# EasyEDA Pro project patched.epro, board PCB1
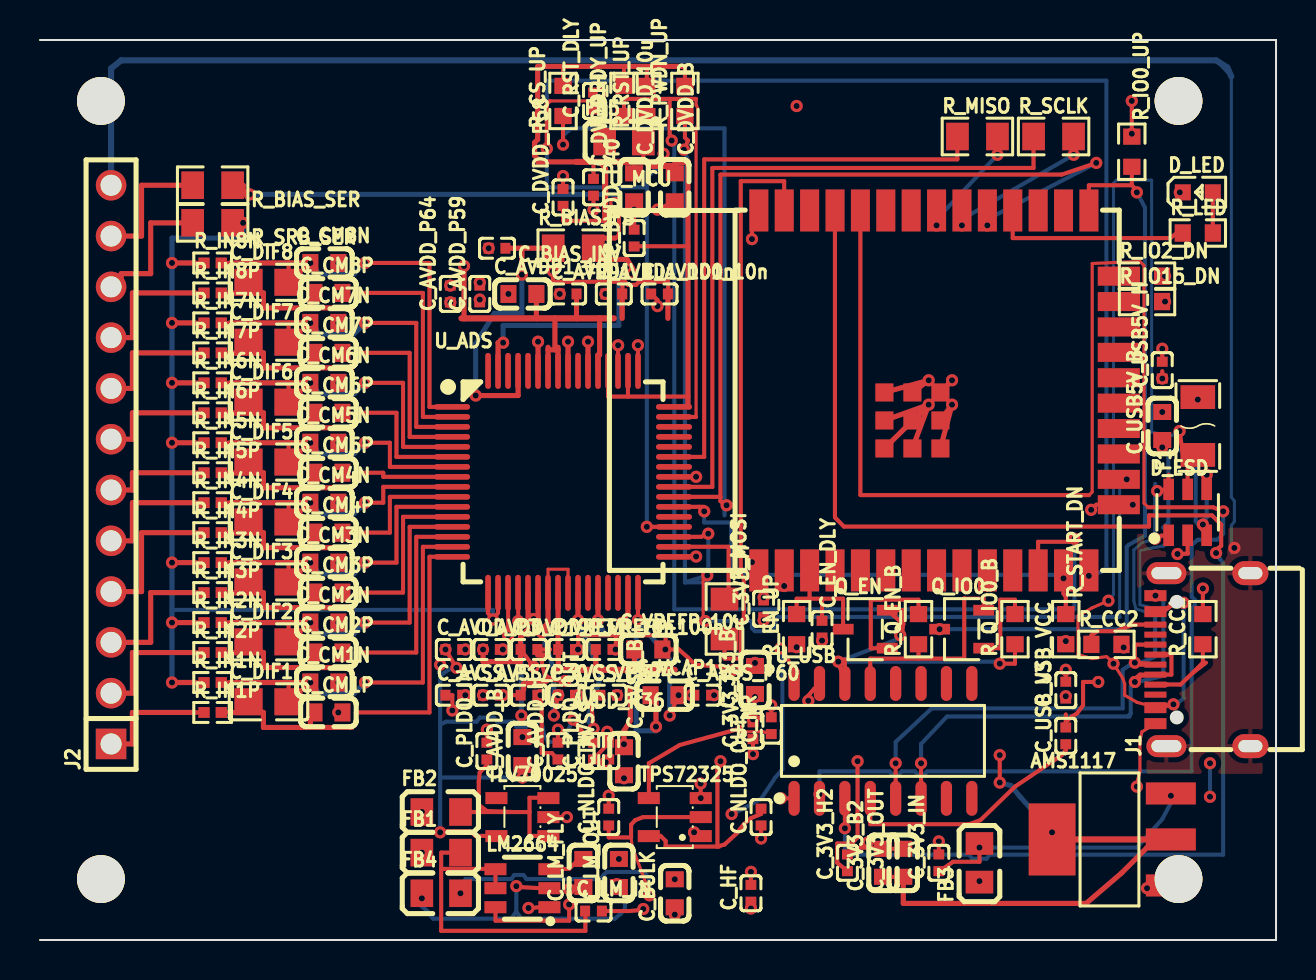
[diagram p5: board, top side]
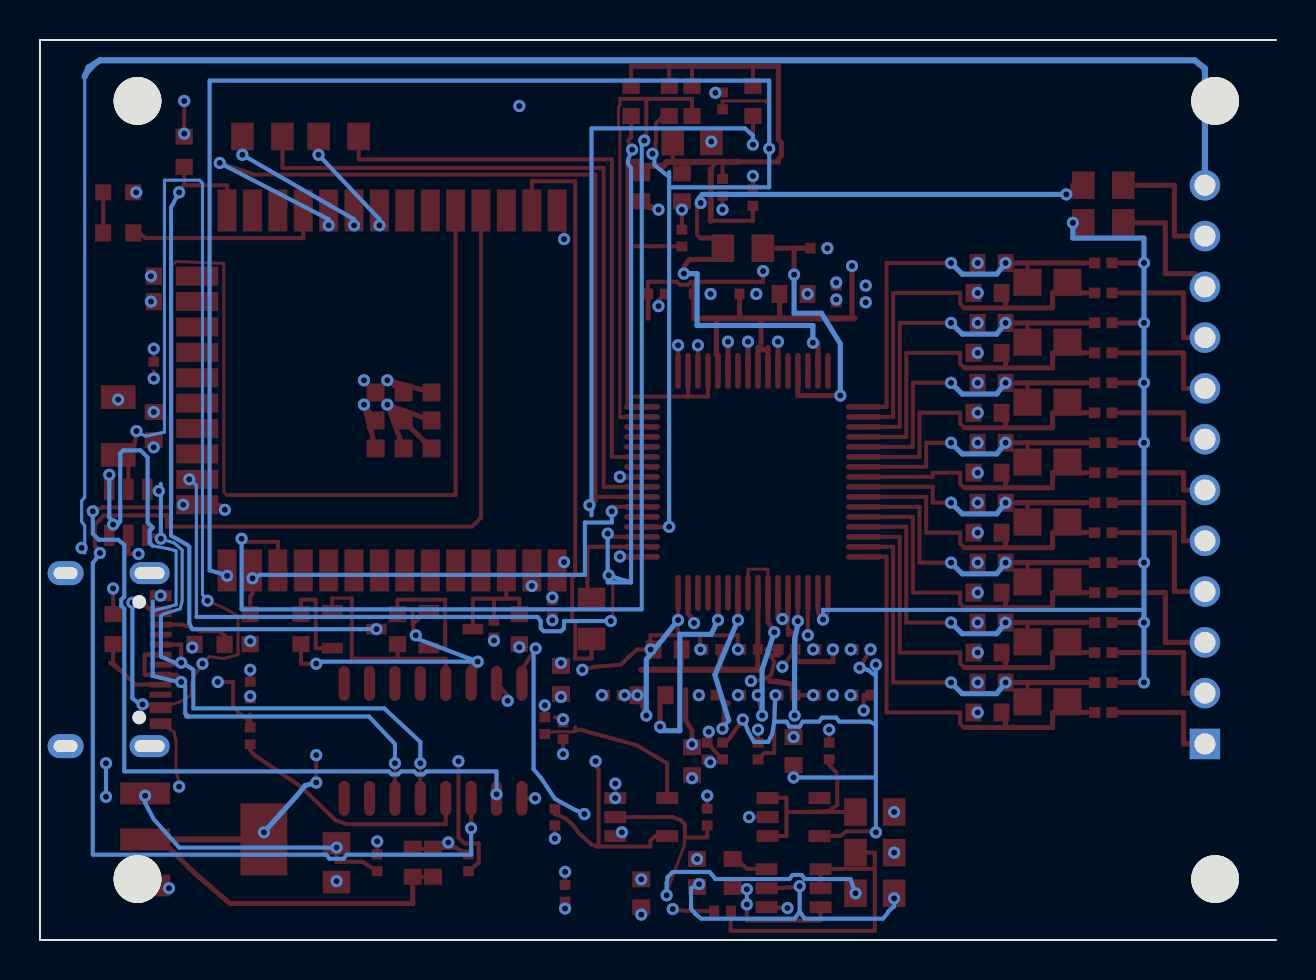
[diagram p6: board, bottom side, seen from below]

Outline 61.82 x 45.01 mm; copper layers: Top Layer, Inner1, Inner2, Bottom Layer. Coordinates in mm from the lower left corner of the outline.
Outline path: 0,45.01 61.82,45.01 61.82,0 0,0
Stack: Top Layer 0.035mm Outer layer thickness 1oz / Dielectric1 0.2104mm 7628 RC49% 8.6mil / Inner1 0.0152mm Inner layer thickness / Dielectric2 1.065mm 1.1mm H/HOZ Copper / Inner2 0.0152mm Inner layer thickness / Dielectric3 0.2104mm 7628 RC49% 8.6mil / Bottom Layer 0.035mm Outer layer thickness 1oz

## Design rules (mm)
spacing copperThickness1oz (default): track to track 0.102, other pairs 0.127 to 0.3
spacing copperThickness2oz: track to track 0.203, other pairs 0.127 to 0.3
track width copperThickness1oz (default): min 0.127, default 0.254, max 2.54
track width copperThickness2oz: min 0.203, default 0.254, max 2.54
differential pair differentialPair (default): width min 0.127, default 0.254, max 2.54; gap min 0.152, default 0.152

## Placement (name value [footprint] x y rotation side)
AMS1117  AMS1117-3.3  [SOT-223-3_L6.5-W3.4-P2.30-LS7.0-BR]  53.59 5.03 0 top
C_3V3_B  1uF  [C0603]  35.76 13 90 top
C_3V3_B2  1uF  [C0603]  42.16 3.86 90 top
C_3V3_H  100nF  [C0402]  35.66 10.47 90 top
C_3V3_H2  100nF  [C0402]  40.39 3.86 90 top
C_3V3_IN  1uF  [C0402]  44.96 3.86 90 top
C_3V3_M  1uF  [C0402]  36.19 16.56 90 top
C_3V3_OUT  1uF  [C0603]  43.18 3.86 90 top
C_AVDD1_1u  1uF  [C0402]  26.42 32.31 0 top
C_AVDD1_10n  100pF  [C0402]  30.99 32.31 0 top
C_AVDD1_10u  1uF  [C0603]  24.13 32.31 0 top
C_AVDD1_100n  100nF  [C0402]  28.7 32.31 0 top
C_AVDD_B  1uF  [C0603]  24.13 9.45 90 top
C_AVDD_H  100nF  [C0402]  25.91 9.45 90 top
C_AVDD_P3  100nF  [C0402]  20.7 14.53 0 top
C_AVDD_P19  100nF  [C0402]  22.58 14.53 0 top
C_AVDD_P31  100nF  [C0402]  24.46 14.53 0 top
C_AVDD_P36  100nF  [C0402]  24.46 12.24 180 top
C_AVDD_P59  100nF  [C0402]  22 32.31 90 top
C_AVDD_P64  100nF  [C0402]  20.52 32.31 90 top
C_AVSS_B  1uF  [C0603]  29.21 8.94 270 top
C_AVSS_H  100nF  [C0402]  28.45 9.45 90 top
C_AVSS_P17  100nF  [C0402]  20.7 12.24 0 top
C_AVSS_P30  100nF  [C0402]  22.58 12.24 0 top
C_AVSS_P37  100nF  [C0402]  26.34 12.24 0 top
C_AVSS_P60  100nF  [C0402]  33.15 12.24 0 top
C_BIAS_INV  100nF  [C0402]  22.86 34.59 180 top
C_BULK  1uF  [C0603]  31.75 2.34 90 top
C_CM1N  1nF  [C0603]  14.22 12.88 0 top
C_CM1P  1nF  [C0603]  14.43 11.38 0 top
C_CM2N  1nF  [C0603]  14.22 15.88 0 top
C_CM2P  1nF  [C0603]  14.43 14.38 0 top
C_CM3N  1nF  [C0603]  14.22 18.87 0 top
C_CM3P  1nF  [C0603]  14.43 17.37 0 top
C_CM4N  1nF  [C0603]  14.22 21.87 0 top
C_CM4P  1nF  [C0603]  14.43 20.37 0 top
C_CM5N  1nF  [C0603]  14.22 24.87 0 top
C_CM5P  1nF  [C0603]  14.43 23.37 0 top
C_CM6N  1nF  [C0603]  14.22 27.86 0 top
C_CM6P  1nF  [C0603]  14.43 26.37 0 top
C_CM7N  1nF  [C0603]  14.22 30.86 0 top
C_CM7P  1nF  [C0603]  14.43 29.36 0 top
C_CM8N  1nF  [C0603]  14.22 33.86 0 top
C_CM8P  1nF  [C0603]  14.43 32.36 0 top
C_DIF1  100nF  [C0805]  11.43 11.91 0 top
C_DIF2  100nF  [C0805]  11.43 14.91 0 top
C_DIF3  100nF  [C0805]  11.43 17.91 0 top
C_DIF4  100nF  [C0805]  11.43 20.9 0 top
C_DIF5  100nF  [C0805]  11.43 23.9 0 top
C_DIF6  100nF  [C0805]  11.43 26.9 0 top
C_DIF7  100nF  [C0805]  11.43 29.9 0 top
C_DIF8  100nF  [C0805]  11.43 32.89 0 top
C_DVDD_10u  1uF  [C0603]  29.72 37.64 270 top
C_DVDD_B  1uF  [C0603]  31.75 37.64 270 top
C_DVDD_H  100nF  [C0402]  27.69 37.64 270 top
C_DVDD_P40  100nF  [C0402]  29.72 35.1 90 top
C_DVDD_P58  100nF  [C0402]  26.16 37.14 90 top
C_EN_DLY  100nF  [C0402]  39.12 15.55 270 top
C_HF  100nF  [C0402]  35.56 2.34 90 top
C_LM_FLY  1uF  [C0603]  27.18 3.35 90 top
C_LM_IN  1uF  [C0402]  27.69 1.45 0 top
C_LM_OUT  1uF  [C0603]  28.96 3.35 90 top
C_NLDO_IN  1uF  [C0402]  28.45 6.15 90 top
C_NLDO_OUT  1uF  [C0402]  36.07 6.15 90 top
C_NR  100pF  [C0402]  36.58 10.72 90 top
C_PLDO_IN  1uF  [C0402]  22.35 9.45 90 top
C_PLDO_OUT  1uF  [C0402]  27.69 9.45 90 top
C_RST_DLY  100nF  [C0402]  27.69 41.96 90 top
C_USB5V_B  1uF  [C0603]  56.13 25.7 90 top
C_USB5V_H  100nF  [C0402]  56.13 28.5 90 top
C_USB_V3  100nF  [C0402]  51.31 10.21 90 top
C_USB_VCC  100nF  [C0402]  51.31 12.5 90 top
C_VCAP1  1uF  [C0603]  31.24 12.24 0 top
C_VCAP4  1uF  [C0402]  28.45 12.24 0 top
C_VREFP_10n  100pF  [C0402]  26.34 14.53 0 top
C_VREFP_10u  1uF  [C0603]  30.43 14.53 0 top
C_VREFP_100n  100nF  [C0402]  28.22 14.53 0 top
D_ESD  USBLC6-2SC6  [SOT-23-6_L2.9-W1.6-P0.95-LS2.8-BL]  57.4 21.39 0 top
D_LED  19-217/GHC-YR1S2/3T  [LED0603-RD]  57.91 37.39 0 top
F1  JK-NSMD050-13.2V  [F1206]  57.91 25.7 90 top
FB1  GZ2012D601TF  [L0805]  20.07 4.37 0 top
FB2  GZ2012D601TF  [L0805]  20.07 6.4 0 top
FB3  GZ2012D601TF  [L0805]  46.99 3.86 90 top
FB4  GZ2012D601TF  [L0805]  20.07 2.34 0 top
FB5  GZ2012D601TF  [L0805]  29.21 39.93 0 top
J1  TYPE-C 16PIN 2MD(073)  [USB-C-SMD_TYPE-C-6PIN-2MD-073]  58.17 14.02 90 top
J2  PZ254V-11-12P  [HDR-TH_12P-P2.54-V-M]  3.56 23.77 90 top
LM2664  LM2664M6X/NOPB  [SOT-23-6_L2.9-W1.6-P0.95-LS2.8-BR]  24.13 2.59 0 top
NOREF  -  [Pad_e526]  56.95 41.96 0 top
NOREF#2  -  [Pad_e528]  56.95 3.05 0 top
NOREF#3  -  [Pad_e525]  3.05 41.96 0 top
NOREF#4  -  [Pad_e527]  3.05 3.05 0 top
Q_EN  S8050 J3Y(RANGE:200-350)  [SOT-23-3_L3.0-W1.7-P0.95-LS2.9-BR]  41.28 15.55 0 top
Q_IO0  S8050 J3Y(RANGE:200-350)  [SOT-23-3_L3.0-W1.7-P0.95-LS2.9-BR]  46.1 15.55 0 top
R_BIAS_FB  1MΩ  [R0805]  26.67 34.59 0 top
R_BIAS_SER  1MΩ  [R0805]  8.64 37.74 180 top
R_CC1  5.1kΩ  [R0603]  58.17 15.55 90 top
R_CC2  5.1kΩ  [R0603]  53.34 14.78 0 top
R_CS_UP  10kΩ  [R0603]  26.16 41.96 90 top
R_DRDY_UP  10kΩ  [R0603]  29.21 41.96 90 top
R_EN_UP  10kΩ  [R0603]  37.85 15.55 90 top
R_IN1N  10kΩ  [R0402]  8.64 12.88 0 top
R_IN1P  10kΩ  [R0402]  8.64 11.38 0 top
R_IN2N  10kΩ  [R0402]  8.64 15.88 0 top
R_IN2P  10kΩ  [R0402]  8.64 14.38 0 top
R_IN3N  10kΩ  [R0402]  8.64 18.87 0 top
R_IN3P  10kΩ  [R0402]  8.64 17.37 0 top
R_IN4N  10kΩ  [R0402]  8.64 21.87 0 top
R_IN4P  10kΩ  [R0402]  8.64 20.37 0 top
R_IN5N  10kΩ  [R0402]  8.64 24.87 0 top
R_IN5P  10kΩ  [R0402]  8.64 23.37 0 top
R_IN6N  10kΩ  [R0402]  8.64 27.86 0 top
R_IN6P  10kΩ  [R0402]  8.64 26.37 0 top
R_IN7N  10kΩ  [R0402]  8.64 30.86 0 top
R_IN7P  10kΩ  [R0402]  8.64 29.36 0 top
R_IN8N  10kΩ  [R0402]  8.64 33.86 0 top
R_IN8P  10kΩ  [R0402]  8.64 32.36 0 top
R_IO0_UP  10kΩ  [R0603]  54.61 39.42 270 top
R_IO2_DN  10kΩ  [R0603]  55.37 33.2 0 top
R_IO15_DN  10kΩ  [R0603]  55.37 31.93 0 top
R_LED  10kΩ  [R0603]  57.91 35.36 0 top
R_MISO  0Ω  [R0805]  46.89 40.18 0 top
R_MOSI  0Ω  [R0805]  34.24 16.05 270 top
R_PWDN_UP  10kΩ  [R0603]  32.26 41.96 90 top
R_Q_EN_B  10kΩ  [R0603]  43.94 15.55 90 top
R_Q_IO0_B  10kΩ  [R0603]  48.77 15.55 90 top
R_RST_UP  10kΩ  [R0603]  30.35 41.96 90 top
R_SCLK  0Ω  [R0805]  50.7 40.18 0 top
R_SRB_SER  0Ω  [R0805]  8.64 35.86 180 top
R_START_DN  10kΩ  [R0603]  51.31 15.55 270 top
TLV70025  TLV70025DDCR  [SOT-23-5_L3.0-W1.7-P0.95-LS2.8-BR]  24.13 6.15 0 top
TPS72325  TPS72325DBVR  [SOT-23-5_L3.0-W1.7-P0.95-LS2.8-BR]  31.75 6.15 0 top
U_ADS  ADS1299IPAGR  [TQFP-64_L10.0-W10.0-P0.50-LS12.0-TL]  26.16 22.91 0 top
U_MCU  2.4GHz  [WIFI-SMD_ESP32-WROOM-32E]  44.96 27.48 0 top
U_USB  CH340C  [SOP-16_L10.0-W3.9-P1.27-LS6.0-BL]  42.16 9.96 0 top

## Footprints (pads in the part's own frame, mm; a bottom-side part is the same pattern mirrored in y, then rotated)
C0402
  rect 0.5x0.54 smd: 1(-0.42,0) 2(0.42,0)
C0603
  rect 0.8x0.9 smd: 1(-0.7,0) 2(0.7,0)
C0805
  rect 1.41x1.35 smd: 1(-1,0) 2(1,0)
F1206
  rect 1.19x1.728 smd: 1(-1.445,0) 2(1.445,0)
HDR-TH_12P-P2.54-V-M
  rect 1.524x1.524 hole 1.05: 1(-13.97,0)
  round 1.524 hole 1.05: 2(-11.43,0) 3(-8.89,0) 4(-6.35,0) 5(-3.81,0) 6(-1.27,0) 7(1.27,0) 8(3.81,0) 9(6.35,0) 10(8.89,0) 11(11.43,0) 12(13.97,0)
L0805
  rect 1.133x1.377 smd: 1(-0.966,0) 2(0.966,0)
LED0603-RD
  rect 0.8x0.8 smd: 1(-0.749,0) 2(0.749,0)
Pad_e525
  round 2.388 hole 2.388: H1(0,0)
Pad_e526
  round 2.388 hole 2.388: H2(0,0)
Pad_e527
  round 2.388 hole 2.388: H3(0,0)
Pad_e528
  round 2.388 hole 2.388: H4(0,0)
R0402
  rect 0.566x0.54 smd: 1(-0.433,0) 2(0.433,0)
R0603
  rect 0.806x0.864 smd: 1(-0.753,0) 2(0.753,0)
R0805
  rect 1.133x1.377 smd: 1(-1,0) 2(1,0)
SOP-16_L10.0-W3.9-P1.27-LS6.0-BL
  oval 0.56x1.745 smd: 1(-4.445,-2.873) 2(-3.175,-2.873) 3(-1.905,-2.873) 4(-0.635,-2.873) 5(0.635,-2.873) 6(1.905,-2.873) 7(3.175,-2.873) 8(4.445,-2.873) 9(4.445,2.873) 10(3.175,2.873) 11(1.905,2.873) 12(0.635,2.873) 13(-0.635,2.873) 14(-1.905,2.873) 15(-3.175,2.873) 16(-4.445,2.873)
SOT-23-3_L3.0-W1.7-P0.95-LS2.9-BR
  rect 1.038x0.532 smd: 1(1.101,-0.95) 2(1.101,0.95) 3(-1.101,0)
SOT-23-5_L3.0-W1.7-P0.95-LS2.8-BR
  rect 1.1x0.6 smd: 1(1.3,-0.95) 2(1.3,0) 3(1.3,0.95) 4(-1.3,0.95) 5(-1.3,-0.95)
SOT-23-6_L2.9-W1.6-P0.95-LS2.8-BL
  rect 0.532x1.072 smd: 1(-0.95,-1.149) 2(0,-1.149) 3(0.95,-1.149) 4(0.95,1.149) 5(0,1.149) 6(-0.95,1.149)
SOT-23-6_L2.9-W1.6-P0.95-LS2.8-BR
  rect 1.1x0.6 smd: 1(1.35,-0.95) 2(1.35,0) 3(1.35,0.95) 4(-1.35,0.95) 5(-1.35,0) 6(-1.35,-0.95)
SOT-223-3_L6.5-W3.4-P2.30-LS7.0-BR
  rect 2.5x1.1 smd: 1(2.97,-2.3) 2(2.97,0) 3(2.97,2.3)
  rect 2.34x3.6 smd: 4(-2.97,0)
TQFP-64_L10.0-W10.0-P0.50-LS12.0-TL
  oval 1.8x0.28 smd: 1(-5.55,3.75) 2(-5.55,3.25) 3(-5.55,2.75) 4(-5.55,2.25) 5(-5.55,1.75) 6(-5.55,1.25) 7(-5.55,0.75) 8(-5.55,0.25) 9(-5.55,-0.25) 10(-5.55,-0.75) 11(-5.55,-1.25) 12(-5.55,-1.75) 13(-5.55,-2.25) 14(-5.55,-2.75) 15(-5.55,-3.25) 16(-5.55,-3.75) 33(5.55,-3.75) 34(5.55,-3.25) 35(5.55,-2.75) 36(5.55,-2.25) 37(5.55,-1.75) 38(5.55,-1.25) 39(5.55,-0.75) 40(5.55,-0.25) 41(5.55,0.25) 42(5.55,0.75) 43(5.55,1.25) 44(5.55,1.75) 45(5.55,2.25) 46(5.55,2.75) 47(5.55,3.25) 48(5.55,3.75)
  oval 0.28x1.8 smd: 17(-3.75,-5.55) 18(-3.25,-5.55) 19(-2.75,-5.55) 20(-2.25,-5.55) 21(-1.75,-5.55) 22(-1.25,-5.55) 23(-0.75,-5.55) 24(-0.25,-5.55) 25(0.25,-5.55) 26(0.75,-5.55) 27(1.25,-5.55) 28(1.75,-5.55) 29(2.25,-5.55) 30(2.75,-5.55) 31(3.25,-5.55) 32(3.75,-5.55) 49(3.75,5.55) 50(3.25,5.55) 51(2.75,5.55) 52(2.25,5.55) 53(1.75,5.55) 54(1.25,5.55) 55(0.75,5.55) 56(0.25,5.55) 57(-0.25,5.55) 58(-0.75,5.55) 59(-1.25,5.55) 60(-1.75,5.55) 61(-2.25,5.55) 62(-2.75,5.55) 63(-3.25,5.55) 64(-3.75,5.55)
USB-C-SMD_TYPE-C-6PIN-2MD-073
  rect 0.55x1.1 smd: 1(-3.2,2.375) 2(-2.4,2.375) 11(2.4,2.375) 12(3.2,2.375)
  rect 0.3x1.1 smd: 3(-1.75,2.375) 4(-1.25,2.375) 5(-0.75,2.375) 6(-0.25,2.375) 7(0.25,2.375) 8(0.75,2.375) 9(1.25,2.375) 10(1.75,2.375)
  oval 1.1x2 hole 0.6x1.5: 13(-4.325,1.825) 14(4.325,1.825)
  oval 1.2x1.8 hole 0.6x1.2: 13(-4.325,-2.375) 14(4.325,-2.375)
WIFI-SMD_ESP32-WROOM-32E
  rect 0.95x2.1 smd: 1(-9.002,-9) 2(-7.732,-9) 3(-6.463,-9) 4(-5.192,-9) 5(-3.922,-9) 6(-2.652,-9) 7(-1.383,-9) 8(-0.113,-9) 9(1.157,-9) 10(2.428,-9) 11(3.697,-9) 12(4.968,-9) 13(6.237,-9) 14(7.508,-9) 25(7.508,9) 26(6.237,9) 27(4.968,9) 28(3.697,9) 29(2.428,9) 30(1.157,9) 31(-0.113,9) 32(-1.383,9) 33(-2.652,9) 34(-3.922,9) 35(-5.192,9) 36(-6.463,9) 37(-7.732,9) 38(-9.002,9)
  rect 2.1x0.95 smd: 15(9.002,-5.715) 16(9.002,-4.445) 17(9.002,-3.175) 18(9.002,-1.905) 19(9.002,-0.635) 20(9.002,0.635) 21(9.002,1.905) 22(9.002,3.175) 23(9.002,4.445) 24(9.002,5.715)
  rect 0.9x0.9 smd: 39(-2.721,-0.1) 39(-2.721,-1.5) 39(-2.721,-2.9) 39(-1.321,-0.1) 39(-1.321,-1.5) 39(-1.321,-2.9) 39(0.079,-0.1) 39(0.079,-1.5) 39(0.079,-2.9)

## Nets
As in the schematic, except:
AVDD: C_AVDD1_1u.1 C_AVDD1_10n.1 C_AVDD1_10u.1 C_AVDD1_100n.1 C_AVDD_B.1 C_AVDD_H.1 C_AVDD_P3.1 C_AVDD_P19.1 C_AVDD_P31.1 C_AVDD_P36.1 C_AVDD_P59.1 C_AVDD_P64.1 C_PLDO_OUT.2 TLV70025.5 U_ADS.19 U_ADS.21 U_ADS.22 U_ADS.31 U_ADS.54 U_ADS.56 U_ADS.59
GND: AMS1117.1 C_3V3_B.2 C_3V3_B2.2 C_3V3_H.2 C_3V3_H2.2 C_3V3_IN.2 C_3V3_M.2 C_3V3_OUT.2 C_AVDD_B.2 C_AVDD_H.2 C_AVDD_P3.2 C_AVDD_P19.2 C_AVDD_P31.2 C_AVDD_P36.2 C_AVDD_P59.2 C_AVDD_P64.2 C_AVSS_B.2 C_AVSS_H.2 C_AVSS_P17.2 C_AVSS_P30.2 C_AVSS_P37.2 C_AVSS_P60.2 C_BIAS_INV.2 C_BULK.2 C_CM1N.2 C_CM1P.2 C_CM2N.2 C_CM2P.2 C_CM3N.2 C_CM3P.2 C_CM4N.2 C_CM4P.2 C_CM5N.2 C_CM5P.2 C_CM6N.2 C_CM6P.2 C_CM7N.2 C_CM7P.2 C_CM8N.2 C_CM8P.2 C_DVDD_10u.2 C_DVDD_B.2 C_DVDD_H.2 C_DVDD_P40.2 C_DVDD_P58.2 C_EN_DLY.2 C_HF.2 C_LM_IN.2 C_LM_OUT.2 C_NLDO_IN.2 C_NLDO_OUT.1 C_NR.2 C_PLDO_IN.2 C_PLDO_OUT.1 C_RST_DLY.2 C_USB5V_B.2 C_USB5V_H.2 C_USB_V3.2 C_USB_VCC.2 D_ESD.2 D_LED.1 J1.1 J1.12 LM2664.1 R_CC1.2 R_CC2.2 R_IO2_DN.2 R_IO15_DN.2 R_START_DN.2 TLV70025.2 TPS72325.1 TPS72325.3 U_ADS.33 U_ADS.41 U_ADS.49 U_ADS.51 U_MCU.1 U_MCU.15 U_MCU.38 U_MCU.39 U_USB.1 U_USB.15
V_NLDO_IN: C_NLDO_IN.1 FB4.2 TPS72325.2

Pads without a net: J1 3 9; NOREF H2; NOREF#2 H4; NOREF#3 H1; NOREF#4 H3; TLV70025 4; U_ADS 27 29 30 37 42 44 45 46 55 60 62 64; U_MCU 4 5 6 7 8 9 10 11 17 18 19 20 21 22 26 27 32 33 36; U_USB 7 8 9 10 11 12

## Via types
v1: diameter 0.61, hole 0.305, Top Layer to Bottom Layer, 238 vias

## Routing (per net, layer and track width the routed paths; a pad name or vN(x,y) marks a point on that pad's centre or on a via; arc(x,y) is an arc through that point)
AVDD: length 53.5
  Top Layer w0.203: v1(23.43,32.31) 23.43,32.51 ; 20.13,14.53 v1(20.28,14.53) v1(20.83,13.61) ; 20.07,5.39 20.32,5.44 21.49,5.44 21.79,5.21 22.3,5.21 ; v1(28.28,32.31) 28.28,32.44 ; 24.42,15.24 24.42,16.1 ; 26.7,11 26.82,10.82 27.13,10.41 27.48,9.91 27.23,10.21 26.92,10.67 26.77,10.82 26.77,10.87 ; 30.58,32.31 30.89,32 v1(30.89,31.7) ; 22.01,14.53 v1(22.16,14.53) ; 23.42,17.36 23.42,15.34 v1(23.42,15.24) ; 20.37,31.89 v1(20.52,31.89) 20.52,31.74 ; v1(25.03,12.24) C_AVDD_P36.1 ; v1(22,32.03) C_AVDD_P59.1 ; C_AVDD1_10n.1 30.57,32.44 ; v1(26,32.31) 26,32.44 ; v1(24.69,16.05) 24.59,16.1 24.42,16.31 ; v1(24.69,13.67) C_AVDD_P31.1 ; v1(24.13,8.13) 24.13,8.74 ; C_AVDD_H.1 25.6,9.35 25.09,9.35 25.09,11.73 25.04,12.14 25.04,12.24
  Top Layer w0.254: 22.16,14.25 22.16,13.92 24.03,13.92 24.03,15.14 24.41,15.55 ; 24.42,16.1 24.91,16.1 24.91,17.36 ; U_ADS.54 v1(27.41,29.92) ; U_ADS.56 v1(26.41,29.92) ; 29.11,16 29.41,16.31 29.41,17.36 ; U_ADS.59 v1(24.91,29.92) ; 24.41,17.36 24.41,16.1
  Bottom Layer w0.203: 20.01,10.77 20.01,13.21 ; 20.01,10.77 20.01,8.13 ; 20.01,10.77 20.32,10.92 21.84,10.92 22,11.13 22.71,11.13 22.86,10.92 23.67,10.92 23.82,10.67 24.33,10.67 24.49,10.92 25.09,10.92 ; 20.01,13.21 20.42,13.51 v1(20.83,13.61) ; 20.01,13.21 v1(20.01,13.77) ; 25.09,10.92 25.2,10.31 25.4,9.91 26.11,9.91 26.42,10.47 26.57,10.87 v1(26.67,11.02) 26.77,10.92 ; 25.09,10.92 25.04,12.09 25.04,12.24 ; 20.01,8.13 v1(24.13,8.13) ; 20.01,8.13 v1(20.01,5.39)
  vias: v1(29.11,15.85)
AVSS: length 82.4
  Top Layer w0.152: U_ADS.23 25.41,18.54 26.41,18.54 U_ADS.25 ; 28.45,8.78 v1(28.3,8.89)
  Top Layer w0.203: 29.13,32.31 29.13,32.92 ; 29.13,32.92 29.26,32.92 29.41,32.77 29.82,32.77 29.97,32.92 31.42,32.92 31.42,32.31 ; 29.13,32.92 25.65,32.92 v1(25.65,33.45) ; v1(31.28,14.53) 31.13,14.53 ; v1(34.7,13.51) 34.09,13.67 32.77,13.77 32.41,14.12 31.95,14.53 31.29,14.53 31.29,15.24 29.92,15.24 ; 28.8,15.24 29.92,15.24 ; 28.8,15.24 26.92,15.24 26.92,14.53 ; 28.8,15.24 28.8,14.53 ; 29.92,15.24 29.92,16 ; 36.07,6.58 36.07,6.3 35.56,6.1 35.2,5.79 34.85,5.33 34.24,4.78 33.88,4.67 ; 33.88,4.67 33.99,4.67 ; 33.88,4.67 31.29,4.67 31.29,4.95 31.04,5.21 TPS72325.5 ; 33.88,4.67 33.88,8.53 34.04,8.74 v1(34.04,8.94) ; 29.02,12.24 v1(28.87,12.24) ; 25.77,12.24 v1(25.92,12.24) v1(25.71,11.23) ; v1(32.58,12.24) C_AVSS_P60.1 ; v1(29.21,9.79) C_AVSS_B.1 ; v1(28.79,14.53) 28.64,14.53 ; 28.45,8.78 C_AVSS_H.1 ; v1(23.92,15.95) 23.92,17.36 ; v1(22.16,12.24) 22.16,12.38 ; 32.09,12.24 31.94,12.24 v1(31.5,11.23) ; v1(26.91,14.53) C_VREFP_10n.2 ; 29.91,16.18 U_ADS.32 ; 20.13,12.24 20.28,12.24 ; v1(20.62,11.48) 20.62,12.24 20.29,12.24
  Top Layer w0.254: U_ADS.58 25.41,29.52 ; 25.41,29.52 25.76,29.52 ; 25.41,29.52 25.41,29.64 ; 27.91,28.46 27.91,29.26 27.99,29.26 27.99,31.09 ; 25.91,29.52 25.91,29.64 ; 25.91,29.52 25.76,29.52 ; 25.91,29.52 U_ADS.57 ; U_ADS.23 25.41,15.9 25.2,15.6 25.09,15.49 ; 29.91,16.18 v1(29.91,16) ; C_AVDD1_10n.2 31.41,31.09 ; v1(21.21,33.71) 21.21,31.09 ; 25.76,29.52 25.76,31.09 ; 29.21,9.92 29.21,10.47 29.53,10.97 29.53,12.52 ; 29.12,32.31 29.12,31.09 ; C_AVDD1_1u.2 26.84,31.09 ; 24.83,32.31 24.83,31.09
  Top Layer w0.305: 21.08,31.09 28.7,31.09
  Bottom Layer w0.254: v1(24.08,11.23) 24.08,15.04 23.92,15.8 ; v1(31.5,11.23) 31.5,14.02 v1(29.91,16) ; v1(25.09,15.39) 25.71,13.51 v1(25.71,11.23)
  vias: v1(31.94,12.24)
DVDD: length 52.1
  Top Layer w0.203: 30.35,42.71 30.35,43.69 ; 31.75,38.34 31.75,38.91 ; 32.41,34.7 29.72,34.7 ; 32.41,27.18 29.41,27.18 ; 29.41,27.18 29.41,27.64 ; 29.41,27.18 28.41,27.18 28.41,27.64 ; 27.69,38.06 27.69,38.91 ; 26.16,42.71 26.16,43.69 ; 27.84,38.91 28.04,38.84 28.27,38.56 ; 28.27,35.97 26.16,35.97 26.16,36.73 ; 32.26,42.71 32.26,43.69 ; 29.72,38.34 29.72,38.91 ; 29.21,42.71 29.21,43.69 ; 30.18,39.29 30.18,38.91
  Top Layer w0.254: 32.41,26.75 32.41,38.91 ; 26.82,38.91 24.89,38.91 24.89,39.07 24.74,39.22 24.74,39.88 24.89,40.03 24.89,43.69 32.26,43.69
  Top Layer w0.305: 32.41,38.91 31.9,38.91 31.75,38.71 30.63,38.71 30.48,38.91 26.82,38.91 ; 28.27,35.97 28.27,38.56
GND: length 80.4
  Top Layer w0.152: 28.25,10.31 v1(28.37,10.41) ; 38.33,12.09 v1(38.43,11.96) ; R_CC2.2 v1(54.2,14.63) ; v1(55.37,2.59) 55.68,2.64 56.57,2.72 ; v1(55.79,17.22) 55.79,17.42 ; J1.1 55.12,10.41 55.02,9.96 55.02,8.43 54.86,7.87 v1(54.86,7.67) ; v1(54.66,21.77) 54.66,21.95
  Top Layer w0.203: v1(21.27,12.24) C_AVSS_P17.2 ; v1(21.27,14.53) C_AVDD_P3.2 ; v1(57.01,37.39) 57.16,37.39 ; U_MCU.15 52.83,21.77 v1(52.58,21.51) ; 31.75,36.94 31.75,36.73 31.09,36.53 v1(30.89,36.53) 31.75,36.94 ; 31.75,36.94 31.75,36.94 ; v1(44.96,4.93) C_3V3_IN.2 ; v1(56.13,29.57) 56.13,28.92 ; v1(26.36,6.15) TLV70025.2 ; v1(14.92,18.87) 14.93,19.08 ; v1(56.27,31.93) R_IO15_DN.2 ; 28.45,10.14 28.25,10.31 ; v1(14.92,27.86) 14.93,28.07 ; TPS72325.1 v1(32.72,5.39) ; 28.45,10.12 C_AVSS_H.2 C_PLDO_OUT.1 ; 32.23,19.18 v1(32.82,19.18) ; v1(14.92,23.37) 14.93,23.57 ; v1(44.45,27.99) 45.04,27.38 ; 45.04,27.38 v1(44.45,26.77) ; 45.04,27.38 v1(45.62,26.77) ; 51.31,12.9 C_USB_VCC.2 v1(51.31,13.51) 51.31,13.57 ; 51.31,11.28 51.31,10.9 ; 51.31,10.9 51.31,10.63 ; 51.31,10.9 51.61,11.18 51.87,11.33 52.17,11.73 52.17,12.9 v1(52.93,12.9) ; 36.58,11.15 v1(36.58,11.73) ; 29.72,35.52 v1(29.72,36.53) 29.72,36.94 ; 24.05,12.24 23.16,12.24 ; 20.52,32.88 v1(20.52,32.73) 20.37,32.73 ; v1(25.91,10.52) C_AVDD_H.2 ; v1(39.12,14.97) C_EN_DLY.2 ; v1(23.15,12.24) C_AVSS_P30.2 ; v1(51.31,14.95) R_START_DN.2 ; v1(14.92,15.88) 14.93,16.08 ; v1(29.21,8.09) C_AVSS_B.2 ; v1(56.9,19.3) 57.1,19.3 57.4,19.33 ; v1(35.61,35.05) 35.61,37.14 35.95,37.39 ; C_3V3_OUT.2 42.16,4.56 ; v1(14.92,32.36) 14.93,32.56 ; v1(32.82,23.17) U_ADS.41 ; v1(35.56,3.41) C_HF.2 ; 38.99,12.84 38.71,12.55 38.41,12.19 38.33,12.09 ; v1(27.69,36.53) 27.69,37.22 ; v1(56.27,33.2) R_IO2_DN.2 ; 24.99,1.65 24.49,1.58 24.28,1.55 v1(24.44,1.6) ; v1(14.92,12.88) 14.93,13.08 ; v1(26.26,12.95) 25.65,13 25.25,13.26 25.09,13.92 25.32,14.25 25.5,14.53 ; 29.91,29.87 29.91,28.46 ; v1(14.92,30.86) 14.93,31.06 ; 33.05,7.11 v1(33.05,7.82) ; 25.51,14.53 25.5,14.53 ; 25.5,14.53 C_AVDD_P31.2 ; 56.57,2.73 56.77,2.73 ; v1(24.13,10.15) 24.33,10.15 ; v1(22.35,10.52) C_PLDO_IN.2 ; v1(28.96,4.05) 29.16,4.05 ; 57.4,19.33 57.4,20.24 ; 57.4,19.33 57.4,19.33 ; v1(35.76,13.86) C_3V3_B.2 ; v1(36.07,5.08) 36.07,5.73 ; v1(22.44,34.59) 22.44,34.73 ; v1(14.92,24.87) 14.93,25.07 ; v1(14.92,29.36) 14.93,29.57 ; v1(35.61,18.9) 35.96,18.48 ; 42.16,4.57 41.15,4.62 v1(41.4,4.88) 40.79,4.47 C_3V3_H2.2 ; 28.91,29.87 28.91,28.46 ; v1(56.13,26.4) 56.34,26.41 ; v1(14.92,17.37) 14.93,17.58 ; v1(37.06,7.09) U_USB.1 ; v1(26.91,12.24) C_AVSS_P37.2 ; C_3V3_H.2 v1(35.66,11.04) 36.07,11.14 ; v1(28.04,42.37) C_RST_DLY.2 ; v1(58.17,17.58) 58.17,16.29 ; v1(28.45,7.22) 28.45,6.57 ; 28.1,1.45 29.46,1.45 30.02,1.5 v1(30.18,1.55) ; v1(33.72,12.24) C_AVSS_P60.2 ; v1(26.16,38.21) 26.16,37.55 ; v1(14.92,21.87) 14.93,22.07 ; v1(14.92,33.86) 14.93,34.06 ; 22,32.89 C_AVDD_P59.2 ; v1(14.92,26.37) 14.93,26.57 ; v1(14.92,11.38) 14.93,11.58 ; v1(14.92,14.38) 14.93,14.58 ; v1(36.19,17.13) C_3V3_M.2 ; v1(31.75,3.04) 31.95,3.04 ; 32.23,19.16 U_ADS.33 ; v1(14.92,20.37) 14.93,20.57 ; v1(23.15,14.53) C_AVDD_P19.2
  Top Layer w0.254: 45.04,25.98 v1(45.62,26.77) U_MCU.39 ; 43.64,25.98 v1(44.45,26.77) ; v1(44.45,26.77) 42.24,24.58 ; v1(44.45,26.77) U_MCU.39 ; v1(44.45,26.77) 42.24,25.98 ; v1(44.45,26.77) 43.64,25.98 ; 25.35,14.25 24.89,14.25 ; 43.64,27.38 v1(44.45,27.99) 42.24,27.38 ; 24.23,12.81 24.18,12.8 ; 24.23,12.81 25.04,12.95 ; 24.23,12.81 24.23,12.81 ; 24.23,12.81 25.3,12.95 ; 24.18,12.8 24.18,12.52 ; 24.18,12.8 24.23,12.81 ; 24.23,12.81 24.19,12.8 24.19,12.52 ; 24.23,12.81 25.35,12.95 ; 45.04,27.38 v1(45.62,27.99)
  vias: v1(22,32.88) v1(28.92,29.74) v1(29.91,29.74) v1(33.05,7.1)
V5_LM_IN: length 15.5
  Top Layer w0.203: 20.07,3.56 20.07,0.46 27.28,0.46 27.28,1.17 ; 20.07,3.56 20.07,4.37 FB1.2 ; 20.07,3.56 22.35,3.56 ; 22.78,3.3 22.78,2.9
VDD_ESP: length 37.3
  Top Layer w0.203: v1(35.76,12.15) C_3V3_B.1 ; v1(54.61,40.32) R_IO0_UP.1 ; v1(28.25,39.93) 28.25,40.13 ; 54.61,40.34 v1(54.61,41.96) ; v1(50.62,5.39) AMS1117.4 ; 37.22,18.14 v1(37.22,17.7) 37.23,18.48 ; v1(35.66,9.3) 35.66,10.06 ; v1(36.19,15.99) C_3V3_M.1 ; C_3V3_H2.1 39.88,3.86 39.88,4.83 40.59,4.83 40.89,5.13 v1(40.89,8.94) ; v1(48.01,7.87) v1(48.01,9.25) ; v1(37.85,14.64) R_EN_UP.1 ; 43.18,3.15 C_3V3_B2.1
  Top Layer w0.254: 55.98,5.03 55.37,4.62 54.1,3.35 52.32,1.83 43.18,1.83 43.18,3.15
  Top Layer w0.305: 55.98,5.03 51.46,5.03
  Bottom Layer w0.254: v1(48.01,7.87) 48.56,7.72 49.02,7.16 v1(50.62,5.39)
  vias: v1(37.85,41.71)
A1_ELEC: length 6.8
  Top Layer w0.254: J2.11 5.08,35.2 5.08,37.74 7.77,37.74
A2_ELEC: length 7.4
  Top Layer w0.254: J2.10 4.06,32.66 4.06,33.33 5.54,33.33 5.54,35.86 7.77,35.86
ADS_CS_N: length 75.2
  Top Layer w0.203: v1(52.83,38.86) 51.1,38.28 34.04,38.28 34.04,22.16 ; 34.04,22.16 34.04,21.95 34.24,21.79 v1(34.34,21.74) ; 34.04,22.16 U_ADS.39 ; R_CS_UP.1 v1(26.16,39.78) ; 47.39,36.48 v1(47.38,35.74) 47.38,36.17
  Bottom Layer w0.203: v1(52.83,38.86) 47.38,36.04 v1(47.38,35.74) ; v1(34.34,21.74) 34.24,21.59 ; 34.24,21.59 34.24,21.23 ; 34.24,21.59 34.24,40.59 26.57,40.59 26.16,40.23 v1(26.16,39.78)
ADS_DIN_LOC: length 5.4
  Top Layer w0.203: 34.24,17.06 34.24,17.25 34.44,17.45 34.44,19.67 31.71,19.67
ADS_DOUT_LOC: length 29.9
  Top Layer w0.203: U_ADS.43 33.22,24.16 33.22,39.04 45.88,39.04 45.88,39.9
ADS_DRDY_N: length 73.2
  Top Layer w0.152: 32.82,26.16 32.82,40.59 32.89,40.74 32.89,41.61 32.82,41.76 32.82,42.06
  Top Layer w0.203: 31.5,42.06 31.5,40.28 31.6,40.13 v1(31.6,39.98) ; 31.5,42.06 32.82,42.06 ; 31.5,42.06 29.21,42.06 R_DRDY_UP.1 ; 31.71,26.16 32.82,26.16 ; 49.92,19.25 49.92,19.91 51.54,19.91 v1(51.74,20.07)
  Bottom Layer w0.203: v1(31.6,39.98) 31.72,39.78 31.72,16.54 51.74,16.54 v1(51.74,20.07)
ADS_PWDN_N: length 60.5
  Top Layer w0.152: v1(54.36,23.04) 54.56,23.04 ; v1(33.38,18.24) 33.32,18.21 33.17,18.03 33.17,16.15 v1(33.27,15.95)
  Top Layer w0.203: 32.26,41.21 32.26,40.13 32.41,39.98 32.31,39.73 32.21,39.62 v1(32.21,39.52) ; v1(33.43,20.32) 33.38,20.3 33.07,20.16 32.61,20.16
  Bottom Layer w0.152: v1(54.36,23.04) 54,22.76 54,16.15
  Bottom Layer w0.203: 32.26,17.88 33.43,17.88 33.43,20.37 ; 32.26,17.88 32.41,17.93 32.77,18.03 v1(33.38,18.24) ; 32.26,17.88 32.26,38.61 32.41,38.81 32.41,39.01 v1(32.21,39.52) ; 54,16.15 36.93,16.15 36.78,15.95 36.78,15.6 36.63,15.44 35.76,15.44 35.61,15.6 35.61,15.95 v1(33.27,15.95)
ADS_RESET_N: length 91.2
  Top Layer w0.152: 27.69,41.96 25.5,41.96
  Top Layer w0.203: v1(31.19,39.32) 31.14,39.4 31.04,39.52 31.04,39.88 31.01,40.03 31.01,40.84 30.63,41.21 ; C_RST_DLY.1 27.69,41.96 ; 25.5,41.96 25.35,41.81 v1(25.35,39.57) ; 52.47,18.48 v1(52.46,18.21) 52.46,18.48 ; v1(30.35,20.66) 30.89,20.66
  Bottom Layer w0.203: 30.35,38.15 30.35,37.64 ; 30.35,38.15 31.09,38.76 31.09,39.17 v1(31.19,39.32) ; 30.35,38.15 30.35,38.41 ; 30.35,37.64 v1(30.35,20.66) ; 30.35,37.64 25.35,37.64 v1(25.35,39.57) 25.35,42.98 53.34,42.98 53.34,18.49 52.83,18.34 52.48,18.21
ADS_SCLK_LOC: length 35.2
  Top Layer w0.203: U_ADS.40 33.63,22.66 33.63,38.61 49.69,38.61 49.69,39.9
ADS_START: length 24.7
  Top Layer w0.203: U_ADS.38 32.97,21.66 ; 32.97,21.66 33.22,21.66 ; 32.97,21.66 33.22,21.49 ; v1(51.19,18.08) 51.2,18.48 ; 51.31,16.29 51.31,17.17 51.19,17.32 51.19,17.53
  Bottom Layer w0.203: v1(51.19,18.08) 50.8,18.26 34.57,18.26 34.57,20.88 33.22,20.88 v1(33.22,21.44)
BIAS_INV: length 14.5
  Top Layer w0.254: C_BIAS_INV.1 24.1,34.59 ; 24.1,34.59 25.67,34.59 ; 24.1,34.59 v1(24.1,33.27) ; 23.92,28.25 23.92,27.23 v1(21.79,27.23)
  Bottom Layer w0.254: v1(21.79,27.23) 21.79,29.82 22.73,31.34 24.1,31.34 v1(24.1,33.27)
BIAS_OUT_INT: length 38.5
  Top Layer w0.152: 28.96,36.88 v1(28.78,36.86)
  Top Layer w0.203: 28.96,36.88 28.96,35.26 28.8,35.1 28.75,35.1 ; R_BIAS_SER.1 10.16,37.46 v1(10.49,37.29)
  Top Layer w0.254: v1(29.62,33.33) 29.62,33.63 29.36,34.04 27.98,34.04 27.67,34.27 ; v1(23.16,29.87) 22.91,29.87 22.91,28.6 ; v1(10.49,37.29) 10.16,37.44 10.16,37.74 R_BIAS_SER.1 9.5,37.74 ; 27.67,34.92 27.67,35.1 28.75,35.1
  Bottom Layer w0.152: 28.96,36.88 v1(28.78,36.86)
  Bottom Layer w0.203: 28.96,36.88 28.96,36.98 28.85,37.14 28.7,37.29
  Bottom Layer w0.254: v1(10.49,37.29) 28.7,37.29 ; v1(23.16,29.87) 23.16,30.73 28.96,30.73 28.96,33.33 v1(29.62,33.33)
CH3_ELEC: length 7.1
  Top Layer w0.203: 7.77,17.37 R_IN3P.1
  Top Layer w0.254: 7.77,17.37 5.54,17.37 5.54,14.88 J2.3
CH5_ELEC: length 5.5
  Top Layer w0.203: 7.77,23.37 R_IN5P.1
  Top Layer w0.254: J2.6 4.62,22.5 4.62,23.37 7.77,23.37
CH6_ELEC: length 6
  Top Layer w0.203: 7.77,26.37 R_IN6P.1
  Top Layer w0.254: J2.7 4.62,25.04 4.62,26.37 7.77,26.37
CH7_ELEC: length 6.4
  Top Layer w0.203: 7.77,29.36 R_IN7P.1
  Top Layer w0.254: J2.8 4.62,27.58 4.62,29.36 7.77,29.36
CH8_ELEC: length 6.9
  Top Layer w0.203: 7.77,32.36 R_IN8P.1
  Top Layer w0.254: J2.9 4.62,30.12 4.62,32.36 7.77,32.36
CH340_V3: length 12
  Top Layer w0.203: 41.53,6.4 41.53,5.79 46.48,5.79 47.04,5.99 48.77,7.67 51.1,9.25 51.31,9.5 51.31,9.79
CH_DTR_N: length 10.3
  Top Layer w0.152: 46.23,17.09 47.21,17.09
  Top Layer w0.203: 43.94,14.07 41.53,14.07 41.53,13.51 ; 43.94,14.07 43.94,14.66 ; 43.94,14.07 46.23,14.07 46.23,17.09 ; 47.21,17.09 47.21,16.66
CH_RTS_N: length 17.8
  Top Layer w0.203: v1(43.03,15.24) 43.13,15.44 43.18,15.8 ; 43.18,15.8 43.18,16.5 42.8,16.5 ; 43.18,15.8 42.38,16.5 ; 40.26,13.51 40.26,14.02 39.98,14.02 ; v1(39.93,13.92) U_USB.14 ; 48.77,14.66 48.77,13.82 v1(48.01,13.82)
  Bottom Layer w0.203: v1(43.03,15.24) 42.88,15.04 v1(39.93,13.92) 47.9,13.92 v1(48.01,13.82)
CHASSIS_GND: length 88.7
  Top Layer w0.254: 60.54,18.35 60.54,18.35 ; 60.54,9.7 60.54,9.7
  Top Layer w0.305: 60.25,10.06 60.54,9.7 60.54,9.69 ; 60.25,17.98 60.54,18.35 60.54,18.35
  Bottom Layer w0.152: v1(59.74,19.61) 59.74,19.51 59.59,19.36 59.59,20.73 59.74,20.93 59.74,21.95 59.59,22.15 59.59,43.18 58.83,43.99
  Bottom Layer w0.305: J2.12 3.56,43.59 4.06,43.99 58.83,43.99 59.38,43.64 59.59,43.18
ECGN_ELEC: length 6.6
  Top Layer w0.203: 7.77,21.87 R_IN4N.1
  Top Layer w0.254: 7.77,21.87 4.62,21.87 4.62,19.96 J2.5
ECGP_ELEC: length 7.6
  Top Layer w0.203: 7.77,20.37 R_IN4P.1
  Top Layer w0.254: 7.77,20.37 5.08,20.37 5.08,17.42 J2.4
ESP_EN: length 6.5
  Top Layer w0.203: 40.17,15.55 40.17,17.07 39.12,17.07 ; 38.49,17.83 38.49,17.07 ; 38.49,17.07 37.85,17.07 37.85,16.29 ; 38.49,17.07 39.12,17.07 ; 39.12,17.07 C_EN_DLY.1
ESP_IO0: length 35.6
  Top Layer w0.203: 54.61,37.74 52.46,37.74 52.46,37.49 ; 54.61,37.74 54.86,37.49 ; 54.61,37.74 R_IO0_UP.2 ; v1(45,15.55) 45.2,15.55
  Bottom Layer w0.203: v1(54.86,37.39) 55.27,36.63 55.27,20.22 54.46,19.76 54.36,19.66 54.36,15.85 54.2,15.55 v1(45,15.55)
ESP_IO2: length 0.7
  Top Layer w0.203: 53.96,33.2 54.62,33.2
ESP_IO15: length 0.7
  Top Layer w0.203: 53.96,31.93 54.62,31.93
ESP_RXD: length 89.9
  Top Layer w0.152: 52.48,22.25 52.63,22.4 52.63,33.83 55.02,33.93 55.22,33.73 55.22,21.84 55.42,21.64
  Top Layer w0.203: 55.42,21.64 58.67,21.64 v1(59.18,21.44) ; 41.05,22.25 52.48,22.25 ; 41.03,35.86 41.03,22.25 ; v1(38.99,7.29) U_USB.2
  Bottom Layer w0.203: v1(38.99,7.29) 38.99,8.43 42.49,8.43 42.65,8.28 42.95,8.28 43.1,8.43 43.76,8.43 43.92,8.28 44.22,8.28 44.37,8.43 57.61,8.43 57.61,16.56 57.76,16.71 57.76,17.02 57.61,17.17 57.61,19.76 57.91,20.02 58.88,20.02 59.18,20.32 v1(59.18,21.44)
ESP_TXD: length 73.7
  Top Layer w0.203: v1(40.26,5.59) 40.26,7.09 ; 39.76,35.86 39.76,21.13 40.21,20.68 55.47,20.68 55.47,21.23 58.62,21.23 59.08,20.78 59.08,19.71 58.88,19.56 v1(58.83,19.36)
  Bottom Layer w0.203: v1(40.26,5.59) 40.26,4.27 46.48,4.27 46.63,4.06 47.35,4.06 47.5,4.27 59.18,4.27 59.18,18.85 59.03,19.05 v1(58.83,19.36)
FP1_ELEC: length 6.2
  Top Layer w0.203: 7.77,11.38 R_IN1P.1
  Top Layer w0.254: J2.1 4.62,9.8 4.62,11.38 7.77,11.38
FP2_ELEC: length 6.7
  Top Layer w0.203: 7.77,14.38 R_IN2P.1
  Top Layer w0.254: J2.2 4.62,12.34 4.62,14.38 7.77,14.38
IN1N: length 19.8
  Top Layer w0.203: 20.61,19.66 19.15,19.66 19.15,12.88 v1(16.26,12.88) ; 12.43,11.91 12.43,12.88 ; 9.5,12.88 R_IN1N.2
  Top Layer w0.254: v1(13.53,12.88) 9.5,12.88
  Bottom Layer w0.254: v1(16.26,12.88) 15.7,12.32 13.97,12.32 v1(13.53,12.88)
IN1P: length 22.4
  Top Layer w0.203: 9.5,11.38 R_IN1P.2 ; 20.61,19.16 19.48,19.16 19.48,11.38 15.8,11.38 15.8,10.83 15.6,10.63 ; 11.18,11.38 10.43,11.91
  Top Layer w0.254: 13.53,10.63 11.18,10.63 11.18,11.38 9.5,11.38 ; 13.53,10.63 13.53,11.38 ; 13.53,10.63 15.6,10.63
IN2N: length 17.8
  Top Layer w0.203: 12.43,14.91 12.43,15.88 ; v1(16.26,15.88) 18.49,15.88 18.49,20.66 20.61,20.66 ; 9.5,15.88 R_IN2N.2
  Top Layer w0.254: v1(13.53,15.88) 9.5,15.88
  Bottom Layer w0.254: v1(13.53,15.88) 13.97,15.32 15.7,15.32 v1(16.26,15.88)
IN2P: length 20.4
  Top Layer w0.203: 11.18,14.38 10.43,14.91 ; 9.5,14.38 R_IN2P.2 ; 15.6,13.63 15.8,13.83 15.8,14.38 18.82,14.38 18.82,20.16 20.61,20.16
  Top Layer w0.254: 13.53,13.63 13.53,14.38 ; 13.53,13.63 15.6,13.63 ; 13.53,13.63 11.18,13.63 11.18,14.38 9.5,14.38
IN3N: length 15.8
  Top Layer w0.203: v1(16.26,18.87) 17.83,18.87 17.83,21.66 20.61,21.66 ; 12.43,17.91 12.43,18.87 ; 9.5,18.87 R_IN3N.2
  Top Layer w0.254: 9.5,18.87 v1(13.53,18.87)
  Bottom Layer w0.254: v1(16.26,18.87) 15.7,18.31 13.97,18.31 v1(13.53,18.87)
IN3P: length 18.4
  Top Layer w0.203: 15.6,16.62 15.8,16.83 15.8,17.37 18.16,17.37 18.16,21.16 20.61,21.16 ; 11.18,17.37 10.43,17.91 ; 9.5,17.37 R_IN3P.2
  Top Layer w0.254: 13.53,16.62 15.6,16.62 ; 13.53,16.62 13.53,17.37 ; 13.53,16.62 11.18,16.62 11.18,17.37 9.5,17.37
IN4N: length 13.8
  Top Layer w0.203: U_ADS.9 17.17,22.66 17.17,21.87 v1(16.26,21.87) ; 9.5,21.87 R_IN4N.2 ; 12.43,20.9 12.43,21.87
  Top Layer w0.254: v1(13.53,21.87) 9.5,21.87
  Bottom Layer w0.254: v1(16.26,21.87) 15.7,21.31 13.97,21.31 v1(13.53,21.87)
IN4P: length 16.4
  Top Layer w0.203: 9.5,20.37 R_IN4P.2 ; 11.18,20.37 10.43,20.9 ; 15.6,19.62 15.8,19.83 15.8,20.37 17.5,20.37 17.5,22.16 U_ADS.10
  Top Layer w0.254: 13.53,19.62 15.6,19.62 ; 13.53,19.62 11.18,19.62 11.18,20.37 9.5,20.37 ; 13.53,19.62 13.53,20.37
IN5N: length 14.2
  Top Layer w0.203: 9.5,24.87 R_IN5N.2 ; 12.43,23.9 12.43,24.87 ; U_ADS.7 17.5,23.66 17.5,24.87 v1(16.26,24.87)
  Top Layer w0.254: v1(13.53,24.87) 9.5,24.87
  Bottom Layer w0.254: v1(13.53,24.87) 13.97,24.31 15.7,24.31 v1(16.26,24.87)
IN5P: length 14.8
  Top Layer w0.203: 15.6,22.62 15.8,22.82 15.8,23.37 17.17,23.37 17.17,23.16 U_ADS.8 ; 11.18,23.37 10.43,23.9 ; 9.5,23.37 R_IN5P.2
  Top Layer w0.254: 9.5,23.37 11.18,23.37 11.18,22.62 13.53,22.62 ; 13.53,22.62 13.53,23.37 ; 13.53,22.62 15.6,22.62
IN6N: length 16.2
  Top Layer w0.203: v1(16.26,27.86) 18.16,27.86 18.16,24.66 U_ADS.5 ; 9.5,27.86 R_IN6N.2 ; 12.43,26.9 12.43,27.86
  Top Layer w0.254: 9.5,27.86 v1(13.53,27.86)
  Bottom Layer w0.254: v1(16.26,27.86) 15.7,27.31 13.97,27.31 v1(13.53,27.86)
IN6P: length 16.8
  Top Layer w0.203: 15.6,25.62 15.8,25.82 15.8,26.37 17.83,26.37 17.83,24.16 U_ADS.6 ; 11.18,26.37 10.43,26.9 ; 9.5,26.37 R_IN6P.2
  Top Layer w0.254: 13.53,25.62 15.6,25.62 ; 13.53,25.62 13.53,26.37 ; 13.53,25.62 11.18,25.62 11.18,26.37 9.5,26.37
IN7N: length 18.2
  Top Layer w0.203: v1(16.26,30.86) 18.82,30.86 18.82,25.66 20.61,25.66 ; 12.43,29.9 12.43,30.86 ; 9.5,30.86 R_IN7N.2
  Top Layer w0.254: 9.5,30.86 v1(13.53,30.86)
  Bottom Layer w0.254: v1(13.53,30.86) 13.97,30.3 15.7,30.3 v1(16.26,30.86)
IN7P: length 18.8
  Top Layer w0.203: 9.5,29.36 R_IN7P.2 ; 15.6,28.61 15.8,28.82 15.8,29.36 18.49,29.36 18.49,25.16 U_ADS.4 ; 11.18,29.36 10.43,29.9
  Top Layer w0.254: 13.53,28.61 11.18,28.61 11.18,29.36 9.5,29.36 ; 13.53,28.61 15.6,28.61 ; 13.53,28.61 13.53,29.36
IN8N: length 20.2
  Top Layer w0.203: 9.5,33.86 R_IN8N.2 ; v1(16.26,33.86) 19.48,33.86 19.48,26.66 20.61,26.66 ; 12.43,32.89 12.43,33.86
  Top Layer w0.254: v1(13.53,33.86) 9.5,33.86
  Bottom Layer w0.254: v1(16.26,33.86) 15.7,33.3 13.97,33.3 v1(13.53,33.86)
IN8P: length 20.8
  Top Layer w0.203: 9.5,32.36 R_IN8P.2 ; 11.18,32.36 10.43,32.89 ; 20.61,26.16 19.15,26.16 19.15,32.36 15.8,32.36 15.8,31.81 15.6,31.61
  Top Layer w0.254: 9.5,32.36 11.18,32.36 11.18,31.61 13.53,31.61 ; 13.53,31.61 15.6,31.61 ; 13.53,31.61 13.53,32.36
LED_A: length 1.7
  Top Layer w0.203: 58.66,37.06 58.66,35.36
LM_CAP_N: length 1.3
  Top Layer w0.203: 25.91,3.56 26.47,3.56 26.97,4.06
LM_CAP_P: length 6.3
  Top Layer w0.203: 26.97,2.67 26.47,2.67 v1(26.47,2.54) ; v1(26.47,1.78) 26.47,0.97 22.78,0.97 22.78,1.42
  Bottom Layer w0.203: v1(26.47,1.78) v1(26.47,2.54)
Q_EN_B: length 5.9
  Top Layer w0.203: 43.94,16.29 43.94,17.02 41.55,17.02 41.55,14.59 41.96,14.59
Q_IO0_B: length 4.3
  Top Layer w0.203: 47.62,14.59 48.03,14.59 48.03,17.02 48.77,17.02 48.77,16.29
SPI_MISO: length 7.2
  Top Layer w0.203: 44.85,36.48 v1(44.84,35.74) 44.84,36.17 ; v1(47.89,39.27) R_MISO.2 ; 47.89,39.9 47.89,39.57
  Bottom Layer w0.203: v1(47.89,39.27) 44.84,36.04 v1(44.84,35.74)
SPI_MOSI: length 28.7
  Top Layer w0.203: 37.22,37.24 37.22,37.95 35.05,37.95 35.05,18.24 35.2,18.08 35.2,16.05 35.05,15.9 35.05,14.07 34.24,14.07 34.24,15.05
SPI_SCK: length 9.2
  Top Layer w0.203: 51.7,39.9 51.7,39.57 ; 46.11,36.17 v1(46.11,35.74) 46.12,36.48 ; v1(51.7,39.27) 51.7,40.18
  Bottom Layer w0.203: v1(51.7,39.27) 46.11,36.04 v1(46.11,35.74)
SRB1: length 57.7
  Top Layer w0.203: 7.77,33.86 R_IN8N.1 ; 7.77,30.86 R_IN7N.1 ; 7.77,27.86 R_IN6N.1 ; 22.4,17.32 22.4,16.36 v1(22.66,16.03) 22.91,16.36 22.91,17.32 ; 7.77,18.87 R_IN3N.1 ; 7.77,24.87 R_IN5N.1 ; 7.77,15.88 R_IN2N.1 ; 7.77,12.88 R_IN1N.1
  Top Layer w0.254: v1(6.6,33.86) 7.77,33.86 ; 9.5,35.86 v1(10.16,35.86) ; v1(6.6,18.87) 7.77,18.87 ; v1(6.6,12.88) 7.77,12.88 ; v1(6.6,24.87) 7.77,24.87 ; v1(6.6,27.86) 7.77,27.86 ; v1(6.6,15.88) 7.77,15.88 ; v1(6.6,30.86) 7.77,30.86
  Bottom Layer w0.203: v1(22.66,16.03) 22.66,16.51 6.6,16.51
  Bottom Layer w0.254: v1(10.16,35.86) 10.16,35.1 6.6,35.1 v1(6.6,33.86) v1(6.6,30.86) v1(6.6,27.86) v1(6.6,24.87) v1(6.6,18.87) v1(6.6,15.88) v1(6.6,12.88)
STATUS_LED_DRV: length 8.7
  Top Layer w0.203: 56.79,35.31 56.54,35.1 48.65,35.1 48.65,35.61
TPS_NR: length 8.5
  Top Layer w0.152: 35.05,10.47 35.1,10.41 36.17,10.41 36.42,10.34 36.58,10.3 36.58,10.39
  Top Layer w0.203: 30.45,7.11 30.45,8.84 32,9.75 34.8,10.52 35.05,10.47 35.05,10.64
USB_5V: length 15.6
  Top Layer w0.203: v1(56.13,24.64) C_USB5V_B.1 ; v1(46.99,2.95) 47.19,2.9 ; v1(37.03,14.58) 37.34,14.12 37.72,13.51 37.72,12.83 ; v1(19.1,4.37) 19.1,4.57 ; v1(35.56,1.58) C_HF.1 ; v1(57.91,27.03) 57.91,27.15 ; v1(31.75,1.27) C_BULK.1 ; 51.31,12.29 C_USB_VCC.1 ; 56.13,28.45 v1(56.13,28.08) ; v1(19.1,6.4) 19.1,6.6
  Bottom Layer w0.203: v1(37.03,14.58) 37.13,14.43 37.13,8.53 36.78,8.13 36.07,7.06 35.05,6.5 34.7,6.35 v1(34.59,6.3) ; v1(58.52,8.84) v1(58.52,7.16)
  vias: v1(51.31,12.19)
USB_CC1: length 5
  Top Layer w0.203: 57.66,13.36 58.32,13.87 ; 57.66,13.36 57.05,12.78 56.39,12.78 ; 57.66,13.36 58.17,13.87 58.17,14.8 ; 55.93,12.78 56.39,12.78 ; 56.39,12.78 J1.4
USB_CC2: length 3.4
  Top Layer w0.203: 52.59,15.04 52.59,15.24 52.88,15.44 53.8,15.44 54.71,15.77 55.65,15.77
USB_DM: length 44.1
  Top Layer w0.152: 58.01,20.68 v1(58.17,20.78)
  Top Layer w0.203: v1(44.07,8.84) 44.07,7.8 ; 56.39,14.28 56.59,14.28 56.59,13.27 56.19,13.27 ; 56.39,14.28 55.93,14.28 ; 56.39,14.28 55.79,14.27 ; 54.91,12.9 55.02,13.21 55.8,13.28 ; 55.32,13.27 55.02,13.27 54.76,13.06 v1(54.76,12.9) ; v1(58.36,23.27) 58.36,22.53 ; 58.01,20.68 58.35,20.24
  Bottom Layer w0.152: 56.19,16.46 55.02,16.76 55.02,19.46 55.37,19.56 56.19,19.71 ; 58.01,20.68 v1(58.17,20.78)
  Bottom Layer w0.203: 56.19,16.92 56.19,13.21 55.12,12.95 v1(54.76,12.9) 54.56,12.7 54.56,11.33 54.41,11.18 ; v1(58.36,23.27) 58.36,21.13 58.01,20.83 58.01,20.68 57.81,20.93 57.81,24.33 57.66,24.49 56.79,24.49 56.44,24.13 56.44,20.88 56.19,20.62 56.34,20.47 56.34,19.86 56.19,19.71 ; v1(44.07,8.84) 44.07,9.8 45.36,11.18 54.41,11.18 ; 54.51,11.18 54.41,11.18
USB_DP: length 33.4
  Top Layer w0.203: 55.32,13.77 54.76,13.77 54.76,14.77 55.32,14.77 ; 56.45,23.27 56.45,22.53 ; 56.45,22.91 56.45,22.53 56.29,22.53 v1(55.88,22.45) ; 56.45,20.24 56.08,20.22 v1(55.78,20.07) ; 54.91,13.87 55.79,13.77 ; v1(42.8,8.84) 42.8,7.8
  Bottom Layer w0.152: 55.78,16.21 55.63,16.31 54.81,16.56 54.71,16.97 54.71,19.51 55.12,19.86 v1(55.78,20.07)
  Bottom Layer w0.203: v1(42.8,8.84) 42.8,9.91 44.6,11.58 54.15,11.58 54.15,13.51 54.46,13.72 v1(54.76,13.87) 55.07,13.87 55.78,14.17 55.78,16.21 ; 55.78,22.81 55.78,22.61 ; 55.78,22.61 v1(55.78,20.07) ; 55.78,22.61 v1(55.88,22.45)
USB_VBUS_RAW: length 59
  Top Layer w0.152: 55.93,11.63 55.89,11.64 55.63,11.68 54.86,11.89 54.25,12.24 54.25,12.8 54.15,13.11 v1(53.7,13.82) 53.59,13.97 53.34,14.17 52.63,14.07 51.92,14.28 51.92,16.21 52.63,16.61 v1(53.44,16.97)
  Top Layer w0.203: v1(57.2,16.87) 57,16.87 56.64,16.76 56.19,16.42 56.59,16.76 56.79,16.87 ; 57.4,23.01 57.4,23.77 57.66,24.03 57.86,24.18 ; 55.93,11.62 56.44,11.73 v1(56.69,11.79) 55.89,11.64 J1.2 ; 57.2,24.03 57.91,24.26 ; 57.2,24.03 v1(57,25.45) ; 57.2,24.03 57.4,24.18
  Bottom Layer w0.152: v1(57,25.45) 56.84,25.35 56.54,25.2 55.6,25.4 55.6,38 53.85,38 53.7,37.85 53.7,17.27 53.54,17.12 v1(53.44,16.97)
  Bottom Layer w0.203: v1(57.2,16.87) 57.2,12.09 56.9,11.84 v1(56.69,11.79)
V_3V3_IN: length 13.7
  Top Layer w0.203: 45.16,3.56 45.67,3.91 46.99,3.91 46.99,4.27 ; v1(46.99,4.62) 46.99,4.83 ; v1(56.57,7.21) 56.56,7.33
  Bottom Layer w0.203: v1(46.99,4.62) 54.86,4.62 56.13,6.05 56.57,6.86 v1(56.57,7.21)
V_NLDO_IN: length 20
  Top Layer w0.152: v1(30.48,2.24) 30.48,2.39 29.62,4.67 29.57,5.13 ; v1(21.03,2.34) 21.03,2.49
  Top Layer w0.203: 32.61,6.15 30.18,6.15 29.77,5.99 29.57,5.77 29.57,5.13 28.45,5.13 28.45,5.73
  Bottom Layer w0.203: v1(30.48,2.24) 30.48,2.84 30.43,3.15 30.18,3.4 28.35,3.4 28.19,3.25 28.04,3.05 24.33,3.05 24.18,3.25 23.72,3.25 23.57,3.05 21.28,3.05 v1(21.03,2.34)
V_PLDO_IN: length 10
  Top Layer w0.203: C_PLDO_IN.1 22.35,8.74 22,8.38 21.95,7.92 21.95,6.76 22.35,6.45 23.62,6.4 ; 24.99,7.11 24.49,7.11 24.49,6.4 ; 23.62,6.4 24.49,6.4 ; 23.62,6.4 21.59,6.4 ; 24.49,6.4 24.49,5.21 24.99,5.21
VCAP1: length 10.9
  Top Layer w0.254: v1(27.91,16) 27.91,17.36 ; v1(30.81,10.67) 30.81,11.84
  Bottom Layer w0.254: v1(30.81,10.67) 30.81,10.47 29.82,10.47 29.82,15.29 28.25,15.29 v1(27.91,16)
VCAP4: length 9.4
  Top Layer w0.203: 27.38,11.84 27.58,11.73 v1(27.69,10.57) ; 27.37,11.84 C_VCAP4.1
  Top Layer w0.254: v1(26.91,16) U_ADS.26
  Bottom Layer w0.203: v1(27.69,10.57) 27.58,10.72 27.38,10.97
  Bottom Layer w0.254: v1(26.91,16) 28.07,13.26 27.37,10.97
VNEG5: length 15.6
  Top Layer w0.203: 23.93,2.69 24.13,2.64 24.99,2.59 ; v1(19.1,2.08) FB4.1 ; 28.96,2.64 v1(28.85,2.79)
  Bottom Layer w0.203: 23.82,1.42 23.57,1.07 19.66,1.07 19.41,1.37 ; 23.82,1.42 24.08,1.07 28.75,1.07 29.06,1.32 29.26,1.58 29.26,2.59 v1(28.85,2.79) ; 23.82,1.42 v1(23.82,2.69) ; 19.41,1.42 19.1,1.68 v1(19.1,2.08)
VREFP: length 11.6
  Top Layer w0.254: C_VREFP_10n.1 25.92,13.51 ; 29.73,14.53 29.73,13.51 ; C_VREFP_100n.1 27.8,13.51 ; U_ADS.24 25.91,14.81
  Top Layer w0.305: 25.78,13.51 31.75,13.51

## Copper pours and planes (outline as drawn; the poured copper is in the pictures)
AVDD on Inner2: 19.05,33.33 33.78,33.33 33.78,13.39 19.05,13.39
AVSS on Inner2: 0.31,43.99 36.32,43.99 36.32,8.18 0.31,8.18
GND on Inner1: 0.31,44.7 59.69,44.7 59.69,0.31 0.31,0.31
VDD_ESP on Inner2: 26.52,43.89 40.64,43.89 40.64,38.41 26.52,38.41
VDD_ESP on Inner2: 26.52,43.89 40.64,43.89 40.64,38.41 26.52,38.41
VDD_ESP on Inner2: 35.56,33.33 49.02,33.33 49.02,8.18 35.56,8.18
VDD_ESP on Inner2: 26.42,43.99 59.69,43.99 59.69,33.33 26.42,33.33
CHASSIS_GND on Top Layer: 54.86,20.62 61.16,20.62 61.16,8.31 54.86,8.31
USB_5V on Inner2: 0.31,8.18 59.69,8.18 59.69,0.31 0.31,0.31
USB_5V on Inner2: 49.02,29.77 59.69,29.77 59.69,0.31 49.02,0.31
